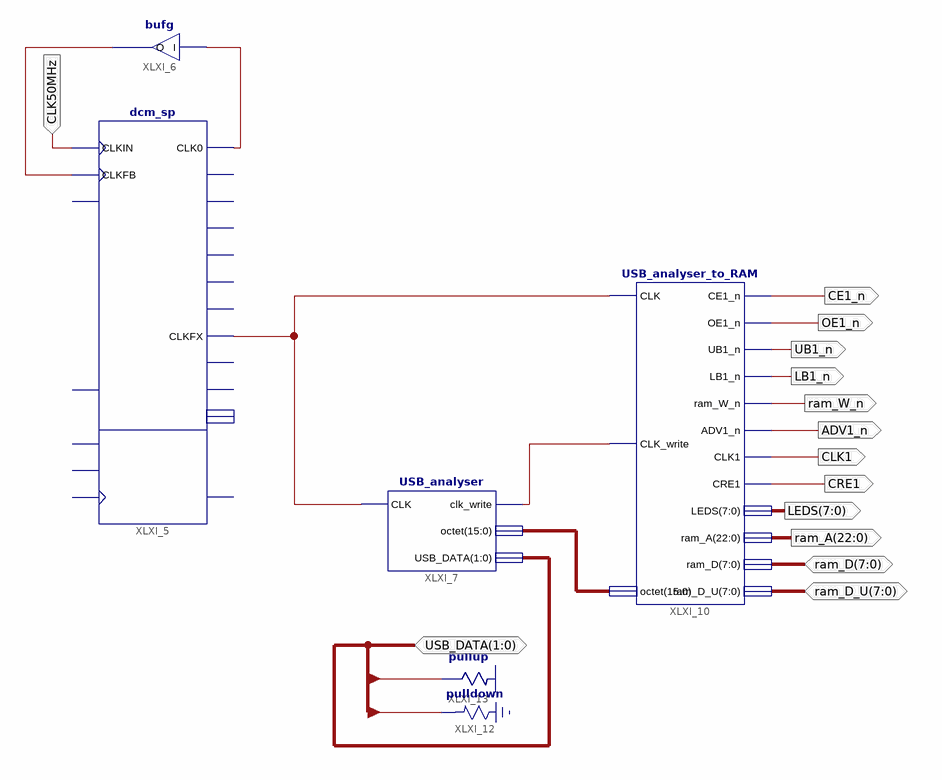
[diagram p0: schematic sheet 1]
// Xilinx ISE schematic USB_analyser_schema.sch (spartan3e) as structural Verilog: 6 symbols, 14 ports
module USB_analyser_schema (
  input  CLK50MHz,
  inout  [1:0] USB_DATA,
  inout  [7:0] ram_D_U,
  inout  [7:0] ram_D,
  output ram_W_n,
  output LB1_n,
  output UB1_n,
  output OE1_n,
  output CE1_n,
  output CRE1,
  output CLK1,
  output [7:0] LEDS,
  output [22:0] ram_A,
  output ADV1_n
);

  wire XLXN_1, XLXN_2, XLXN_26, XLXN_27;
  wire [15:0] XLXN_25;

  dcm_sp #(.CLKFX_MULTIPLY(6), .CLKFX_DIVIDE(5)) XLXI_5 (
    .CLKFB(XLXN_2), .CLKIN(CLK50MHz), .CLK0(XLXN_1), .CLKFX(XLXN_27));  // open: DSSEN, PSCLK, PSEN, PSINCDEC, RST, CLK180, CLK270, CLK2X, CLK2X180, CLK90, CLKDV, CLKFX180, LOCKED, PSDONE, STATUS
  bufg XLXI_6 (.I(XLXN_1), .O(XLXN_2));
  USB_analyser XLXI_7 (.CLK(XLXN_27), .clk_write(XLXN_26), .octet(XLXN_25), .USB_DATA(USB_DATA));
  \pullup  XLXI_13 (.O(USB_DATA[1]));
  \pulldown  XLXI_12 (.O(USB_DATA[0]));
  USB_analyser_to_RAM XLXI_10 (
    .CLK(XLXN_27), .CLK_write(XLXN_26), .octet(XLXN_25), .CE1_n(CE1_n), .OE1_n(OE1_n), .UB1_n(UB1_n),
    .LB1_n(LB1_n), .ram_W_n(ram_W_n), .ADV1_n(ADV1_n), .CLK1(CLK1), .CRE1(CRE1), .LEDS(LEDS), .ram_A(ram_A),
    .ram_D(ram_D), .ram_D_U(ram_D_U));
endmodule
